# EAGLE design Maduino Zero Lorawan Node v1.0 (EAGLE 6.1)
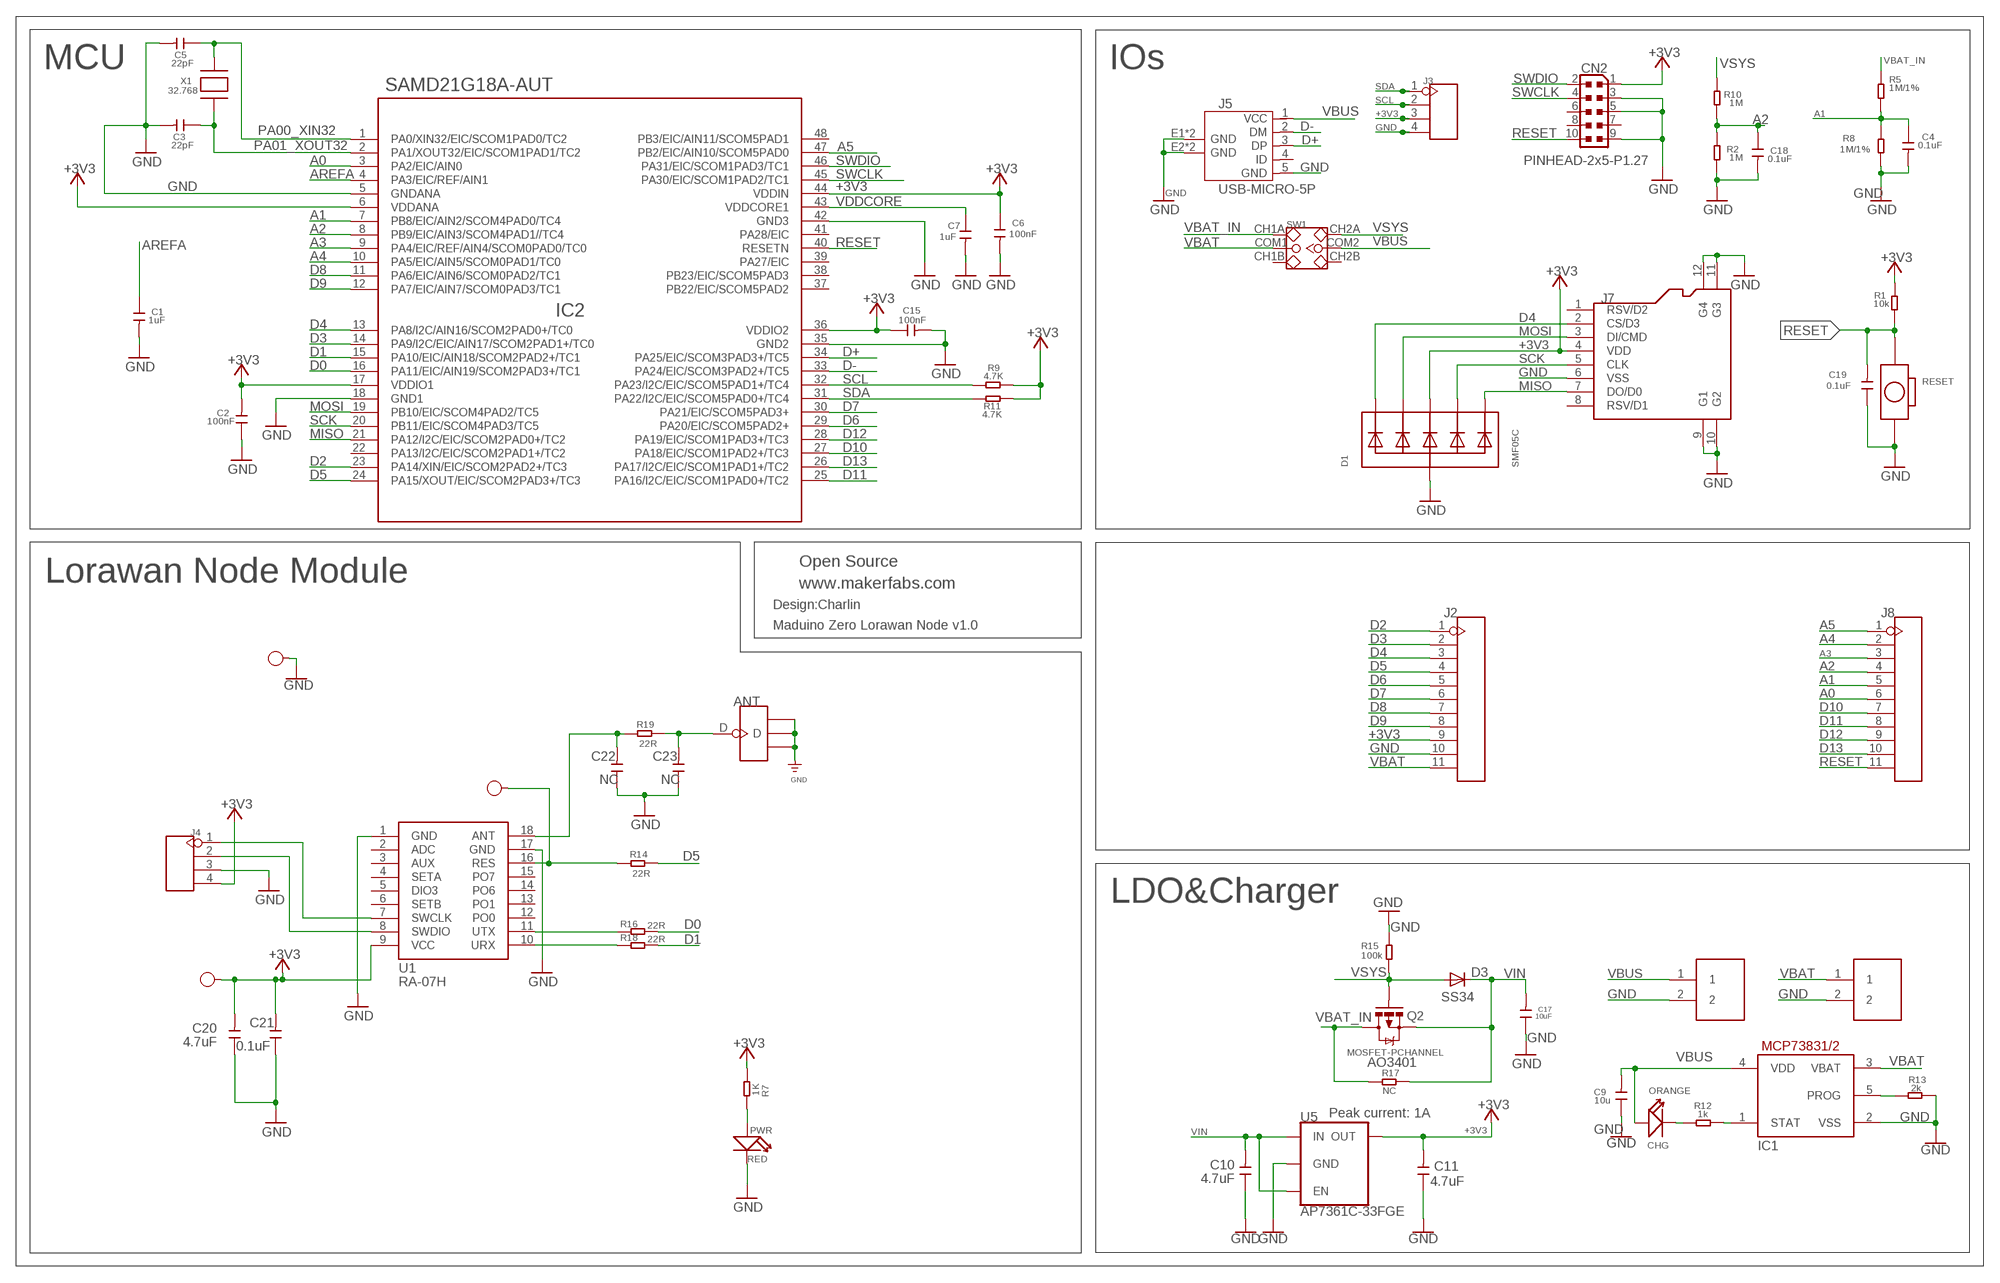
[diagram p0: schematic, sheet 1]

## Parts
3V3  TEST-POINT'4545'  [TP-D45MIL]
ANT  ANTENNA-U-FL  [4P-U-FL]
C1  1uF  C-0603  [C0603]
C2  100nF  C-0603  [C0603]
C3  22pF  C-0603  [C0603]
C4  0.1uF  C-0603  [C0603]
C5  22pF  C-0603  [C0603]
C6  100nF  C-0603  [C0603]
C7  1uF  C-0603  [C0603]
C9  10u  C-0603  [C0603]
C10  4.7uF  C-0603  [C0603]
C11  4.7uF  C-0603  [C0603]
C15  100nF  C-0603  [C0603]
C17  10uF  C-0603  [C0603]
C18  0.1uF  C-0603  [C0603]
C19  0.1uF  C-0603  [C0603]
C20  4.7uF  C-0603  [C0603]
C21  0.1uF  C-0603  [C0603]
C22  NC  C-0603  [C0603]
C23  NC  C-0603  [C0603]
CHG  ORANGE  007-LED0603  [D0603]
CN2  PINHEAD-2x5-P1.27  0171_PH127-205DF055G00AROUND-PADS  [PINHEAD_2X05_127]
D1  SMF05C  TVSARRAY_5LANE  [SOT363]
D3  SS34  DIODE-DO-214AC  [DO-214AC]
GND  TEST-POINT'4545'  [TP-D45MIL]
IC1  MCP73831/OT  [SOT23-5L]
IC2  SAMD21G18A-AUT  ATSAMD21G18A-AUT  [TQFP48-7X7]
J1  PH2.0-2P-90-DIP  [PH2.0-2P-90-DIP]
J2  HEADER-11P-2.54  [11P-2.54]
J3  HEADER-4P-60/35MILROUND  [4P-65/35ROUND]
J4  HEADER-4P-60/35MILROUND  [4P-65/35ROUND]
J5  USB-MICRO-5P  [MICRO-USB-5P]
J6  PH2.0-2P-90-DIP  [PH2.0-2P-90-DIP]
J7  HOLDER-MICROSD-8P  [8P-SMD]
J8  HEADER-11P-2.54  [11P-2.54]
PWR  RED  LED'0603'  [LED-0603]
Q2  MOSFET-PCHANNEL  [SOT23-3]
R1  10k  R-0603  [R0603]
R2  1M  R-0603  [R0603]
R5  1M/1%  R-0603  [R0603]
R7  1K  R-0603  [R0603]
R8  1M/1%  R-0603  [R0603]
R9  4.7K  R-0603  [R0603]
R10  1M  R-0603  [R0603]
R11  4.7K  R-0603  [R0603]
R12  1k  R-0603  [R0603]
R13  2k  R-0603  [R0603]
R14  22R  R-0603  [R0603]
R15  100k  R-0603  [R0603]
R16  22R  R-0603  [R0603]
R17  NC  R-0603  [R0603]
R18  22R  R-0603  [R0603]
R19  22R  R-0603  [R0603]
RES  TEST-POINT'4545'  [TP-D45MIL]
RESET  BOTTON-2P-90D  [2P-7.62X3.56-90D]
SW1  SWITCH-2CH-6P  [6P-2CH-2.54-7.6X3.0]
U1  RA-07H  [SMD18-127P-1600L1600W]
U5  AP7361C-33FGE  [8-UDFN]
X1  32.768  XTAL-3.2X1.5  [XTAL3215]

## Nets
+3V3: 3V3.T C2.2 C6.1 C11.2 C15.1 C20.2 C21.2 CN2.1 D1.4(C3) IC2.6(VDDANA) IC2.17(VDDIO1) IC2.36(VDDIO2) IC2.44(VDDIN) J2.9 J3.3 J4.4 J7.4(VDD) R1.2 R7.1 R9.2 R11.2 U1.9(VCC) U5.1(OUT)
A0: IC2.3(PA2/EIC/AIN0) J8.6
A1: C4.1 IC2.7(PB8/EIC/AIN2/SCOM4PAD0/TC4) J8.5 R5.1 R8.2
A2: C18.1 IC2.8(PB9/EIC/AIN3/SCOM4PAD1//TC4) J8.4 R2.2 R10.1
A3: IC2.9(PA4/EIC/REF/AIN4/SCOM0PAD0/TC0) J8.3
A4: IC2.10(PA5/EIC/AIN5/SCOM0PAD1/TC0) J8.2
A5: IC2.47(PB2/EIC/AIN10/SCOM5PAD0) J8.1
AREFA: C1.1 IC2.4(PA3/EIC/REF/AIN1)
D0: IC2.16(PA11/EIC/AIN19/SCOM2PAD3+/TC1) R16.2
D1: IC2.15(PA10/EIC/AIN18/SCOM2PAD2+/TC1) R18.2
D2: IC2.23(PA14/XIN/EIC/SCOM2PAD2+/TC3) J2.1
D3: IC2.14(PA9/I2C/EIC/AIN17/SCOM2PAD1+/TC0) J2.2
D4: D1.1(C1) IC2.13(PA8/I2C/AIN16/SCOM2PAD0+/TC0) J2.3 J7.2(CS/D3)
D5: IC2.24(PA15/XOUT/EIC/SCOM2PAD3+/TC3) J2.4 R14.2
D6: IC2.29(PA20/EIC/SCOM5PAD2+) J2.5
D7: IC2.30(PA21/EIC/SCOM5PAD3+) J2.6
D8: IC2.11(PA6/EIC/AIN6/SCOM0PAD2/TC1) J2.7
D9: IC2.12(PA7/EIC/AIN7/SCOM0PAD3/TC1) J2.8
D10: IC2.27(PA18/EIC/SCOM1PAD2+/TC3) J8.7
D11: IC2.25(PA16/I2C/EIC/SCOM1PAD0+/TC2) J8.8
D12: IC2.28(PA19/EIC/SCOM1PAD3+/TC3) J8.9
D13: IC2.26(PA17/I2C/EIC/SCOM1PAD1+/TC2) J8.10
D+: IC2.34(PA25/EIC/SCOM3PAD3+/TC5) J5.3(DP)
D-: IC2.33(PA24/EIC/SCOM3PAD2+/TC5) J5.2(DM)
GND: ANT.GND1 ANT.GND2 ANT.GND3 C1.2 C2.1 C3.2 C4.2 C5.2 C6.2 C7.2 C9.1 C10.1 C11.1 C15.2 C17.1 C18.2 C19.1 C20.1 C21.1 C22.1 C23.1 CN2.3 CN2.5 CN2.9 D1.2(A) GND.T IC1.2(VSS) IC2.5(GNDANA) IC2.18(GND1) IC2.35(GND2) IC2.42(GND3) J1.2 J2.10 J3.4 J4.3 J5.5(GND) J5.E1(GND) J5.E2(GND) J5.P1(GND) J5.P2(GND) J6.2 J7.6(VSS) J7.9(G1) J7.10(G2) J7.11(G3) J7.12(G4) PWR.- R2.1 R8.1 R13.2 R15.2 RESET.P$2 U1.1(GND) U1.17(GND) U5.4(GND) U5.EP(GND)
MISO: D1.6(C5) IC2.21(PA12/I2C/EIC/SCOM2PAD0+/TC2) J7.7(DO/D0)
MOSI: D1.3(C2) IC2.19(PB10/EIC/SCOM4PAD2/TC5) J7.3(DI/CMD)
N$3: PWR.+ R7.2
N$4: R16.1 U1.11(UTX)
N$5: R18.1 U1.10(URX)
N$6: R14.1 RES.T U1.16(RES)
N$8: J4.1 U1.7(SWCLK)
N$9: J4.2 U1.8(SWDIO)
N$12: C22.2 R19.1 U1.18(ANT)
N$13: ANT.D C23.2 R19.2
N$25: CHG.- R12.1
N$26: IC1.1(STAT) R12.2
N$31: IC1.5(PROG) R13.1
PA00_XIN32: C5.1 IC2.1(PA0/XIN32/EIC/SCOM1PAD0/TC2) X1.P$2
PA01_XOUT32: C3.1 IC2.2(PA1/XOUT32/EIC/SCOM1PAD1/TC2) X1.P$1
RESET: C19.2 CN2.10 IC2.40(RESETN) J8.11 R1.1 RESET.P$1
SCK: D1.5(C4) IC2.20(PB11/EIC/SCOM4PAD3/TC5) J7.5(CLK)
SCL: IC2.32(PA23/I2C/EIC/SCOM5PAD1+/TC4) J3.2 R9.1
SDA: IC2.31(PA22/I2C/EIC/SCOM5PAD0+/TC4) J3.1 R11.1
SWCLK: CN2.4 IC2.45(PA30/EIC/SCOM1PAD2/TC1)
SWDIO: CN2.2 IC2.46(PA31/EIC/SCOM1PAD3/TC1)
VBAT: IC1.3(VBAT) J2.11 J6.1 SW1.COM1
VBAT_IN: Q2.3(D) R5.2 R17.1 SW1.CH1A
VBUS: C9.2 CHG.+ IC1.4(VDD) J1.1 J5.1(VCC) SW1.COM2
VDDCORE: C7.1 IC2.43(VDDCORE1)
VIN: C10.2 C17.2 D3.C Q2.2(S) R17.2 U5.5(EN) U5.8(IN)
VSYS: D3.A Q2.1(G) R10.2 R15.1 SW1.CH2A
Unconnected: CN2.6 CN2.7 CN2.8 IC2.22(PA13/I2C/EIC/SCOM2PAD1+/TC2) IC2.37(PB22/EIC/SCOM5PAD2) IC2.38(PB23/EIC/SCOM5PAD3) IC2.39(PA27/EIC) IC2.41(PA28/EIC) IC2.48(PB3/EIC/AIN11/SCOM5PAD1) J5.4(ID) J7.1(RSV/D2) J7.8(RSV/D1) SW1.CH1B SW1.CH2B U1.2(ADC) U1.3(AUX) U1.4(SETA) U1.5(DIO3) U1.6(SETB) U1.12(PO0) U1.13(PO1) U1.14(PO6) U1.15(PO7)

## Notes on the sheet
- MCU | IOs
- Open Source
- Lorawan Node Module
- www.makerfabs.com
- Design:Charlin
- Maduino Zero Lorawan Node v1.0
- LDO&Charger
- AO3401
- Peak current: 1A

## Library data of the parts
3V3 GND RES = Discrete-new:TEST-POINT; PARTNO: DNP
ANT = Connector:ANTENNA-U-FL
C1-C7 C9-C11 C15 C17-C23 = Discrete:C*: Ceramic Capacitors
CHG = Discrete:007-LED*
CN2 = Connettori:0171_PH127-205DF055G00A: 2x5 PASSO 1,27
D1 = microbuilder:TVSARRAY_5LANE: Voltage Transient Suppressor Array SOT363 SMF05C - 100W 5V: Digikey - SMF05CT1GOSCT-ND
D3 = diode:DIODE-: DIODE
IC1 = adafruit:MCP73831: MCP73831/2 Miniature Single-Cell, Fully Integrated Li-Ion, Li-Polymer Charge Management Controllers. Nice and small simple lipoly charge controller, with adjustable current and status output (LED) http://www.ladyada.net/library/pcb/eaglelibrary.html
IC2 = IC:ATSAMD21G18A-AUT: Atmel D21 32bit ARM Cortex-M0 microcontroller - 48 PIN TQFP 256KB flash memory + 32KB SRAM
J1 J6 = Connector:PH2.0-2P-90-DIP
J2 J8 = Connector:HEADER-11P
J3 J4 = Connector:HEADER-4P
J5 = Connector:USB-MICRO-5P
J7 = Connector:HOLDER-MICROSD-8P
PWR = Discrete:LED*
Q2 = User-Submitted:MOSFET-PCHANNEL: Generic PMOSFET IRLML2244 - TRANS-11153 (SOT-23 -20V -4.3A) (1.Gate 2.Source 3.Drain) FQP27P06 - COM-10349 <http://www.sparkfun.com/products/10349> (TO-220 -60V -27A) (1.Gate 2.Source 3.Drain); PROD_ID: TRANS-08285
R1 R2 R5 R7-R19 = Discrete:R*
RESET = Discrete:BOTTON-2P
SW1 = Discrete:SWITCH-2CH-6P
U1 = self:RA-07H
U5 = ublox:AP7361C-33FGE: AP7361C 3.3V LDO Regulator; PROD_ID: VREG-14094
X1 = adafruit2:XTAL: Low cost SMT crystals, no capacitors included http://www.ladyada.net/library/eagle

## Net classes
0 default: width 0.203 mm, drill 0.305 mm, clearance 0.152 mm
2 gnd: width 0.305 mm, drill 0.559 mm, clearance 0.254 mm
3 usbvcc: width 0.508 mm, drill 0.61 mm, clearance 0.254 mm
4 USBpair: width 0.254 mm, drill 0.406 mm, clearance 0.406 mm

## Board
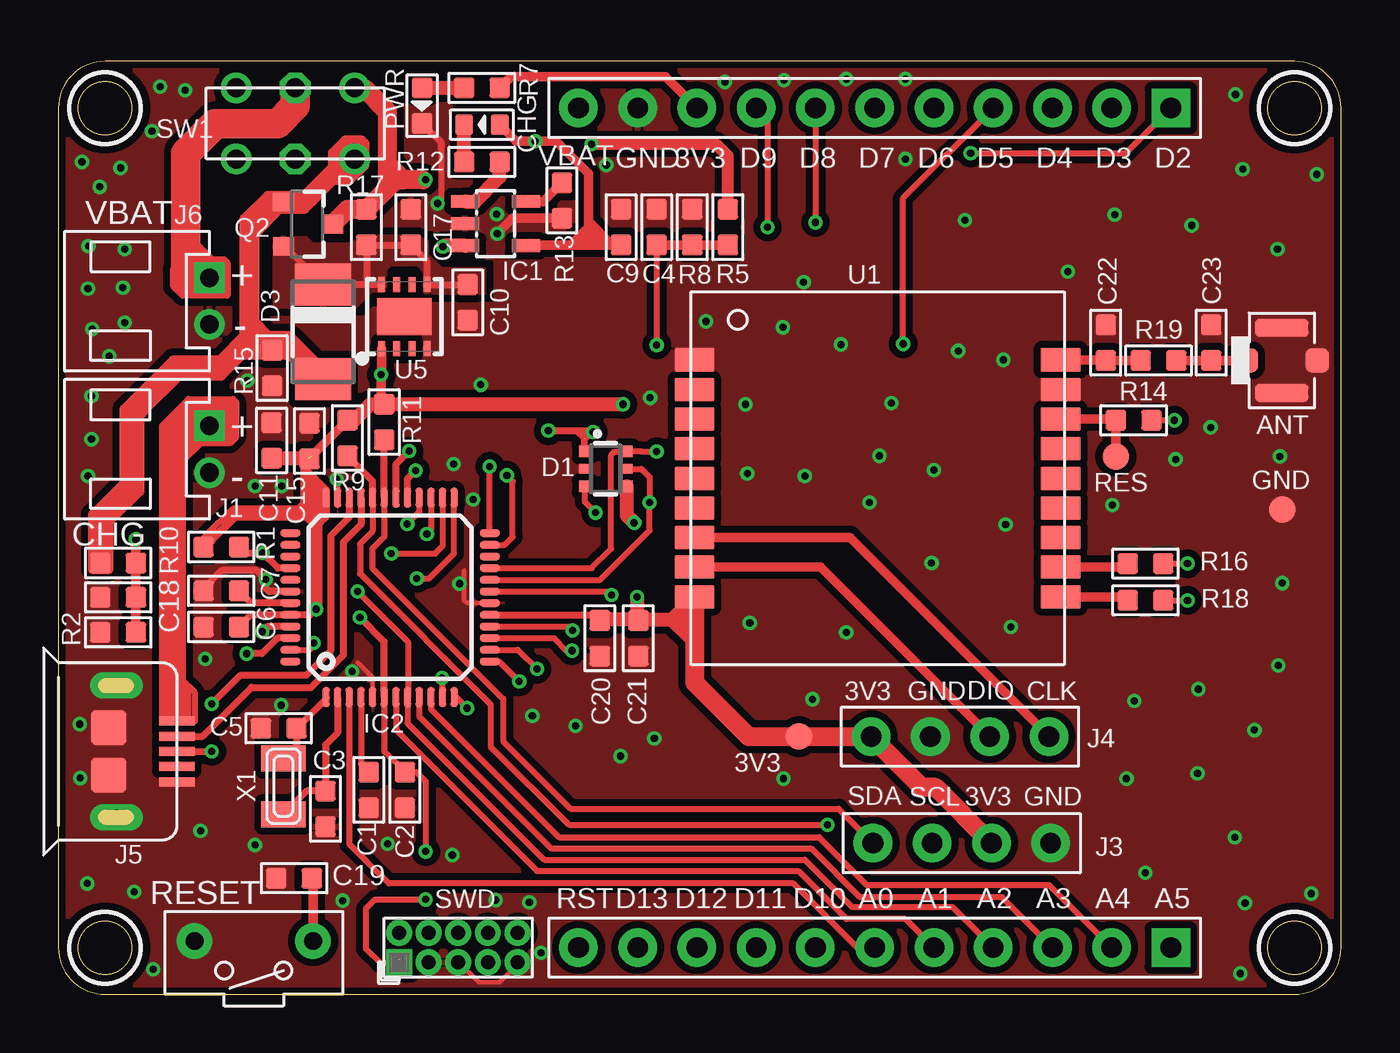
[diagram p1: board, top side]
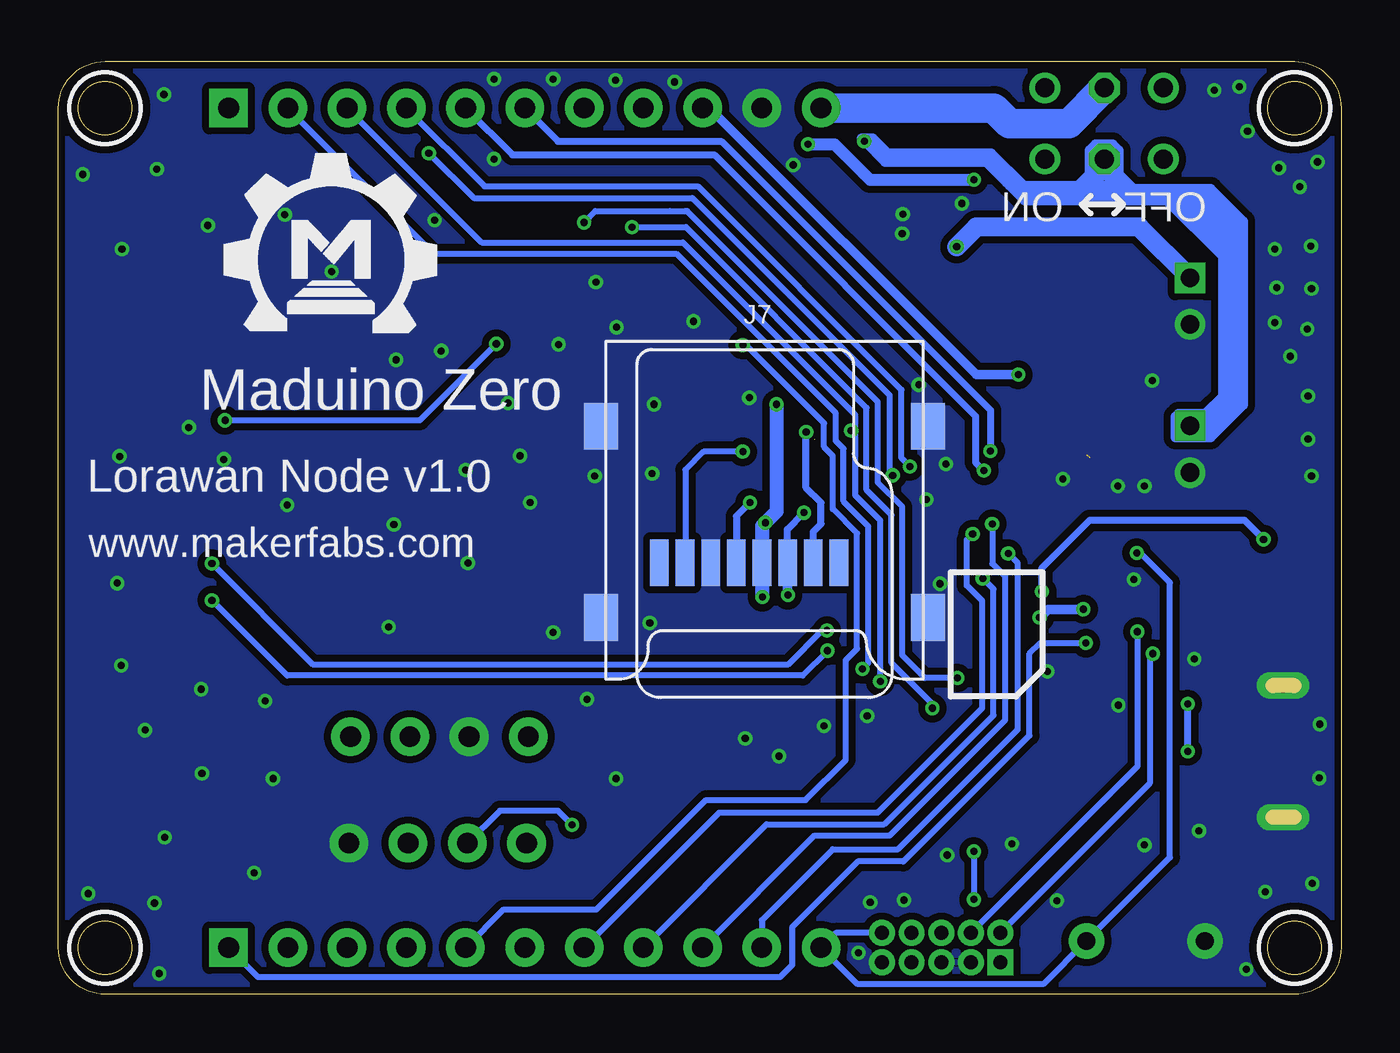
[diagram p2: board, bottom side, seen from below]

Size 55 x 40 mm. Coordinates in mm from the lower left corner, seen from the top.
Outline: 0,38 0,2 arc90 2,0 53,0 arc90 55,2 55,38 arc90 53,40 2,40 arc90 0,38
Outline: circle at 53,2 radius 1.14
Outline: circle at 53,38 radius 1.14
Outline: circle at 2,2 radius 1.14
Outline: circle at 2,38 radius 1.14
Copper layers (1*16): Top 0.035mm / dielectric 1.5mm / Bottom 0.035mm
Design rules: minimum track width 6mil, minimum drill 10mil, track to track 6mil, track to pad 6mil, pad to pad 6mil, via to via 6mil, smd to smd 0mil, copper to edge 10mil, drill to drill 10mil, minimum pad ring 10mil, minimum via ring 6mil, stop-mask expansion 2mil, vias tented up to drill 30mil, thermal gap 0mil
tRestrict: area 51.5,0.5 to 54.5,3.5; area 51.5,36.5 to 54.5,39.5; area 0.5,0.5 to 3.5,3.5; area 0.5,36.5 to 3.5,39.5
bRestrict: area 51.5,0.5 to 54.5,3.5; area 51.5,36.5 to 54.5,39.5; area 0.5,0.5 to 3.5,3.5; area 0.5,36.5 to 3.5,39.5

### Footprints (pad centres in the part's own frame; a part is rotated, then mirrored left to right if it is on the bottom)
TP-D45MIL = smd 1.143 x 1.143: T 0,0
4P-U-FL = smd 1.016 x 1.016: D -1.524,0; GND3 1.524,0 | smd 2.286 x 0.762: GND1 0,1.397; GND2 0,-1.397
C0603 = smd 0.889 x 0.889: 1 -0.762,0; 2 0.762,0
D0603 = smd 0.762 x 0.889: + -0.762,0; - 0.762,0
PINHEAD_2X05_127 = drill 0.6 pad 1.016 square: 1 -0.635,2.54 | drill 0.6 pad 1.016: 2 0.635,2.54; 3 -0.635,1.27; 4 0.635,1.27; 5 -0.635,0; 6 0.635,0; 7 -0.635,-1.27; 8 0.635,-1.27; 9 -0.635,-2.54; 10 0.635,-2.54
SOT363 = smd 0.5 x 0.5: 1 -0.75,-0.9; 3 0.75,-0.9; 4 0.75,0.9; 6 -0.75,0.9 | smd 0.4 x 0.5: 2 0,-0.9; 5 0,0.9
DO-214AC = smd 1.8 x 2.4: A 2.025,0; C -2.025,0
SOT23-5L = smd 0.55 x 1.2: 1 -0.95,-1.3; 2 0,-1.3; 3 0.95,-1.3; 4 0.95,1.3; 5 -0.95,1.3
TQFP48-7X7 = smd 0.85 x 0.32: 1 -4.275,2.75; 2 -4.275,2.25; 3 -4.275,1.75; 4 -4.275,1.25; 5 -4.275,0.75; 6 -4.275,0.25; 7 -4.275,-0.25; 8 -4.275,-0.75; 9 -4.275,-1.25; 10 -4.275,-1.75; 11 -4.275,-2.25; 12 -4.275,-2.75; 25 4.275,-2.75; 26 4.275,-2.25; 27 4.275,-1.75; 28 4.275,-1.25; 29 4.275,-0.75; 30 4.275,-0.25; 31 4.275,0.25; 32 4.275,0.75; 33 4.275,1.25; 34 4.275,1.75; 35 4.275,2.25; 36 4.275,2.75 | smd 0.32 x 0.85: 13 -2.75,-4.275; 14 -2.25,-4.275; 15 -1.75,-4.275; 16 -1.25,-4.275; 17 -0.75,-4.275; 18 -0.25,-4.275; 19 0.25,-4.275; 20 0.75,-4.275; 21 1.25,-4.275; 22 1.75,-4.275; 23 2.25,-4.275; 24 2.75,-4.275; 37 2.75,4.275; 38 2.25,4.275; 39 1.75,4.275; 40 1.25,4.275; 41 0.75,4.275; 42 0.25,4.275; 43 -0.25,4.275; 44 -0.75,4.275; 45 -1.25,4.275; 46 -1.75,4.275; 47 -2.25,4.275; 48 -2.75,4.275
PH2.0-2P-90-DIP = drill 0.8 square: 1 0,1 | drill 0.8: 2 0,-1
11P-2.54 = drill 0.889 pad 1.651 square: 1 0,12.7 | drill 0.889 pad 1.651: 2 0,10.16; 3 0,7.62; 4 0,5.08; 5 0,2.54; 6 0,0; 7 0,-2.54; 8 0,-5.08; 9 0,-7.62; 10 0,-10.16; 11 0,-12.7
4P-65/35ROUND = drill 0.889 pad 1.651: 1 0,3.81; 2 0,1.27; 3 0,-1.27; 4 0,-3.81
MICRO-USB-5P = smd 0.38 x 1.52: 1 -1.3,0; 2 -0.65,0; 3 0,0; 4 0.65,0; 5 1.3,0 | smd 1.524 x 1.524: E1 -1.016,-2.921; E2 1.016,-2.921 | drill 0.635 pad 1.143 long: P1 -2.819,-2.591; P2 2.819,-2.591
8P-SMD = smd 0.8 x 2.008: 1 -3.198,0.254; 2 -2.098,0.254; 3 -0.998,0.254; 4 0.102,0.254; 5 1.202,0.254; 6 2.302,0.254; 7 3.402,0.254; 8 4.502,0.254 | smd 1.45 x 2: 9 -7.002,2.6; 10 7.002,2.6; 11 -7.002,-5.598; 12 7.002,-5.598
LED-0603 = smd 0.889 x 0.889: + -0.762,0; - 0.762,0
SOT23-3 = smd 0.8 x 0.9: 1 -0.95,-1; 2 0.95,-1; 3 0,1.1
R0603 = smd 0.889 x 0.889: 1 -0.762,0; 2 0.762,0
2P-7.62X3.56-90D = drill 0.762 pad 1.524: P$1 0,2.54; P$2 0,-2.54
6P-2CH-2.54-7.6X3.0 = drill 0.813 pad 1.27: CH1A -1.524,2.54; CH1B -1.524,-2.54; CH2A 1.524,2.54; CH2B 1.524,-2.54 | drill 0.813 pad 1.27 octagon: COM1 -1.524,0; COM2 1.524,0
SMD18-127P-1600L1600W = smd 1.7 x 1: 1 -7.85,5.08; 2 -7.85,3.81; 3 -7.85,2.54; 4 -7.85,1.27; 5 -7.85,0; 6 -7.85,-1.27; 7 -7.85,-2.54; 8 -7.85,-3.81; 9 -7.85,-5.08; 10 7.85,-5.08; 11 7.85,-3.81; 12 7.85,-2.54; 13 7.85,-1.27; 14 7.85,0; 15 7.85,1.27; 16 7.85,2.54; 17 7.85,3.81; 18 7.85,5.08
8-UDFN = smd 0.3 x 0.65: 1 -0.975,-1.375; 2 -0.325,-1.375; 3 0.325,-1.375; 4 0.975,-1.375; 5 0.975,1.375; 6 0.325,1.375; 7 -0.325,1.375; 8 -0.975,1.375 | smd 2.35 x 1.6: EP 0,0
XTAL3215 = smd 1.1 x 1.9: P$1 1.2,0; P$2 -1.2,0

### Placement (x,y rotation side)
3V3  31.75,11.05 0 top
ANT  52.45,27.18 0 top
C1  13.31,8.76 270 top
C2  14.86,8.76 90 top
C3  11.46,7.95 270 top
C4  25.65,32.89 90 top
C5  9.45,11.4 180 top
C6  6.99,15.75 180 top
C7  6.99,17.3 180 top
C9  24.13,32.89 270 top
C10  17.55,29.67 90 top
C11  9.14,23.75 270 top
C15  10.77,23.72 90 top
C17  15.11,32.89 270 top
C18  2.57,17.02 180 top
C19  10.11,4.98 0 top
C20  23.22,15.27 90 top
C21  24.87,15.27 90 top
C22  44.91,27.94 270 top
C23  49.43,27.94 270 top
CHG  18.16,37.29 180 top
CN2  17.14,2 90 top
D1  23.47,22.53 270 top
D3  11.35,28.4 270 top
GND  52.48,20.78 0 top
IC1  18.75,33.05 270 top
IC2  14.22,17.02 90 top
J1  6.48,23.37 0 top
J2  35,38 270 top
J3  38.73,6.48 90 top
J4  38.66,11.05 270 top
J5  5.08,10.41 270 top
J6  6.48,29.72 0 top
J7  24.73,18.76 180 bottom
J8  35,2 270 top
PWR  15.6,38.1 270 top
Q2  10.67,33.02 270 top
R1  6.99,19.18 180 top
R2  2.57,15.52 0 top
R5  28.7,32.89 90 top
R7  18.16,38.86 180 top
R8  27.18,32.89 270 top
R9  12.4,23.85 90 top
R10  2.57,18.49 180 top
R11  13.97,24.54 90 top
R12  18.16,35.69 0 top
R13  21.59,34.04 270 top
R14  46.1,24.61 0 top
R15  9.17,26.85 270 top
R16  46.61,18.47 0 top
R17  13.21,32.89 270 top
R18  46.61,16.89 0 top
R19  47.17,27.18 0 top
RES  45.34,23.06 0 top
RESET  8.38,2.29 270 top
SW1  10.16,37.34 270 top
U1  35.13,22.12 0 top
U5  14.83,29.06 0 top
U$1  [MAKERFABS_0.3]  47.43,28.42 0 bottom
X1  9.65,8.92 270 top

### Tracks (layer width: path | path; a pad name or v marks a point on that pad's centre or on a via)
+3V3  (via drill 0.3)  (1 unrouted)
  Top 0.254: 11.43,21.72 11.43,21.08 10.92,20.57 11.18,20.57 11.43,20.83 11.43,20.57 | 11.43,21.72 10.67,22.48 10.67,21.21 10.29,20.83 7.49,20.83 6.35,19.68 6.6,19.43 7.62,20.45 10.79,20.45 | 11.43,20.57 11.35,20.5 11.2,20.5 10.72,20.98 10.72,22.05 10.82,22.15 10.82,22.07 11.3,21.59 11.3,21.26 10.97,20.93 10.97,21.72 10.87,21.82 10.9,21.82 11.12,21.59 11.12,21.31 | 11.51,21.31 11.51,20.65 11.43,20.57 | 11.43,21.72 11.51,21.64 11.51,20.68 11.35,20.52 | 6.66,19.89 6.55,19.89 6.12,19.46 6.12,19.28 R1.2 | CN2.1 14.59,1.35 13.79,1.35 13.18,1.96 13.18,3.66 13.59,4.06 v15.75,4.06 | IC2.6 13.97,10.41 C2.2 15.34,9.53 15.75,9.12 v15.75,6.12
  Top 0.305: IC2.6 13.97,15.11 v12.93,16.15 | v11.05,16.51 10.79,16.26 9.91,16.26 | IC2.36 11.47,21.13 11.43,21.08 11.05,20.7 | 11.05,20.7 11.05,20.19 | IC2.44 9.92,16.27 9.91,16.26 | 10.67,20.7 11.05,20.7 | 10.67,20.7 10.54,20.83 10.54,22.73 C15.1 | R1.2 7.75,20.7 10.67,20.7 | 9.91,16.26 8.26,16.26 C6.1 | IC2.17 23.27,16.27 23.22,16.22 C20.2 | C21.2 24.87,16.19 24.94,16.27
  Top 0.406: 10.54,23.11 10.9,23.11 R9.2 | U5.1 13.86,26.58 v13.84,26.57 13.84,25.43 | R7.1 19.41,39.34 26.04,39.34 J2.9 | J2.9
  Top 0.508: 11.05,20.19 v11.05,16.51 | 10.79,20.45 11.05,20.19 | 11.05,20.19 11.35,20.5
  Top 0.61: C11.2 10.74,22.99 C15.1 | R9.2 12.7,24.61 13.39,25.3 R11.2 | D1.4 24.37,20.54 v24.69,20.22 | v24.82,17.03 24.82,16.08 | 24.82,16.08 C21.2 | 24.82,16.08 26.29,16.08 | 26.29,16.08 26.31,16.08 | 26.31,16.08 27.25,16.08 27.28,16.05 | 24.82,16.08 23.27,16.08 C20.2 | 26.31,16.08 27.2,16.97 27.2,15.16 | 27.2,15.14 27.2,15.16 | 27.2,15.16 26.29,16.08 | R11.2 v24.21,25.3 | R11.2 13.84,25.43
  Top 0.813: U1.9 27.28,16.05 27.28,13.36 29.59,11.05 3V3.T J4.4 37.03,8.87 37.62,8.87 J3.3
  Bottom 0.254: 24.82,18.52 J7.4 | v15.75,6.12 v15.75,4.06
  Bottom 0.305: v11.05,16.5 v11.05,16.51
  Bottom 0.406: J2.9 27.08,38 15.65,26.57 v13.84,26.57 | v11.05,16.5 12.58,16.5 v12.93,16.15
  Bottom 0.61: 24.82,18.52 24.82,20.09 v24.69,20.22 24.21,20.7 v24.21,25.3 | J7.4 24.83,17.04 v24.82,17.03
A0
  Top 0.254: IC2.3 12.47,6.45 13.07,5.86 13.26,5.66 14.17,4.75 31.52,4.75 34.27,2 J8.6
A1  (via drill 0.3)
  Top 0.254: IC2.7 14.47,11.33 20.52,5.28 31.73,5.28 33.78,3.23 36.31,3.23 J8.5 | C4.1 v25.65,27.84
  Top 0.406: C4.1 R8.2 R5.1
  Bottom 0.254: J8.5 35.91,3.63 31.93,3.63 27.23,8.33 22.96,8.33 21.23,10.06 21.23,14.33 20.75,14.81 20.75,19.76 21.79,20.8 21.79,23.09 22.17,23.47 22.17,24.49 25.53,27.84 v25.65,27.84
A2  (via drill 0.3)
  Top 0.254: 14.99,12.76 14.99,15.11 v12.83,17.27 | IC2.8 14.97,11.62 20.83,5.77 32,5.77 34.04,3.73 38.35,3.73 J8.4
  Top 0.305: 14.99,12.76 IC2.8
  Top 0.406: R2.2 C18.1 R10.1 v3.33,19.51
  Bottom 0.305: v12.83,17.27 12.83,18.29 10.79,20.32 4.14,20.32 v3.33,19.51
A3
  Top 0.254: IC2.9 15.47,11.91 21.13,6.25 32.28,6.25 34.37,4.17 40.45,4.17 J8.3
A4
  Top 0.254: IC2.10 15.97,12.22 21.46,6.73 32.61,6.73 34.67,4.67 42.49,4.67 J8.2
A5  (via drill 0.3)
  Top 0.254: IC2.47 10.78,14.77 10.95,14.94 v10.95,15.06
  Bottom 0.254: J8.1 46.44,0.74 24.05,0.74 23.55,1.25 23.55,2.87 20.73,5.69 18.77,5.69 13.36,11.1 13.36,14.61 12.9,15.06 v10.95,15.06
AREFA
  Top 0.254: IC2.4 12.97,9.86 C1.1
D0  (via drill 0.3)
  Top 0.254: IC2.16 21.88,15.77 v22.05,15.6 | R16.2 v48.41,18.47
  Bottom 0.254: v48.41,18.47 44.09,14.15 23.7,14.15 22.25,15.6 v22.05,15.6
D1  (via drill 0.3)
  Top 0.254: IC2.15 21.26,15.27 21.79,14.73 v22.02,14.73 | R18.2 v48.41,16.89
  Bottom 0.254: v22.02,14.73 23.09,13.66 45.19,13.66 v48.41,16.89
D2  (via drill 0.3)
  Top 0.254: IC2.23 19.14,19.27 19.48,19.61 19.48,22 v19.23,22.25 | v39.12,36.07 45.77,36.07 J2.1
  Bottom 0.254: v39.12,36.07 37.19,34.14 27.81,34.14 19.36,25.68 19.36,22.38 v19.23,22.25
D3  (via drill 0.3)
  Top 0.254: IC2.14 19.7,14.77 v20.52,13.95
  Bottom 0.254: J2.2 38.91,31.75 28.5,31.75 21.67,24.92 21.67,23.72 21.34,23.39 21.34,21.13 20.27,20.07 20.27,14.2 v20.52,13.95
D4  (via drill 0.3)  (1 unrouted)
  Top 0.254: IC2.13 18.9,14.27 v19.76,13.41 | 22.58,23.8 22.91,24.13 | 22.55,23.8 22.55,23.82 22.23,24.16
  Top 0.305: D1.1 22.57,24.03 22.43,24.17 | v21.01,24.17 22.43,24.17 | 22.43,24.17 22.87,24.17 22.91,24.13 v22.94,24.11
  Bottom 0.254: J2.3 36.85,32.23 28.22,32.23 20.83,24.84 20.83,24.21 | v19.76,13.41 19.76,20.32 20.83,21.39 20.83,24.21 | v21.01,24.17 20.87,24.17 20.83,24.21
  Bottom 0.305: J7.2 22.63,19.84 22.3,20.17 22.3,21.08 22.94,21.72 v22.94,24.11
D5  (via drill 0.3)
  Top 0.254: R14.2 v47.85,24.61 | v36.22,27.89 36.22,34.14 J2.4 | IC2.24 v18.5,22.62 v18.49,22.63
  Bottom 0.254: v47.85,24.61 39.5,24.61 v36.22,27.89 | J2.4 36.73,34.65 27.58,34.65 18.85,25.91 18.85,22.99 v18.49,22.63
D6  (via drill 0.3)
  Top 0.305: IC2.29 14.97,22.11 v15.32,22.45
  Bottom 0.305: J2.5 35.53,35.99 26.87,35.99 15.67,24.79 15.67,22.81 v15.32,22.45
D7  (via drill 0.3)
  Top 0.305: IC2.30 14.47,22.73 v15.04,23.29
  Bottom 0.305: J2.6 33.58,36.58 26.57,36.58 15.04,25.04 v15.04,23.29
D8  (via drill 0.3)
  Top 0.254: IC2.11 16.47,13.55 v16.46,13.56 | J2.7 v32.46,33.1
  Bottom 0.254: v32.46,33.1 31.98,33.58 28.78,33.58 28.12,33.58 28.04,33.58 19.86,25.4 19.86,21.95 18.82,20.9 18.82,14.53 17.86,13.56 v16.46,13.56
D9  (via drill 0.3)
  Top 0.254: J2.8 30.4,37.52 v30.4,32.89 | IC2.12 17.05,12.74 v17.53,12.27
  Bottom 0.254: v30.4,32.89 28.09,32.89 20.34,25.15 20.34,21.61 19.28,20.55 19.28,14.2 17.53,12.45 v17.53,12.27
D10  (via drill 0.3)
  Top 0.254: IC2.27 15.97,19.91 v15.8,19.74
  Bottom 0.254: J8.7 26.66,7.8 19.86,7.8 15.39,12.27 15.39,16.87 16.05,17.53 16.05,19.48 v15.8,19.74
D11  (via drill 0.3)
  Top 0.254: IC2.25 16.97,18.9 15.9,17.83 v15.37,17.83
  Bottom 0.254: v15.37,17.83 14.91,17.37 14.91,11.96 19.58,7.29 24.63,7.29 J8.8
D12  (via drill 0.3)
  Top 0.254: IC2.28 15.47,20.68 v14.96,20.17
  Bottom 0.254: v14.96,20.17 14.96,18.47 14.4,17.91 14.4,11.76 19.36,6.81 22.57,6.81 J8.9
D13  (via drill 0.3)
  Top 0.254: IC2.26 16.47,19.22 16.15,18.9 v14.28,18.9
  Bottom 0.254: v14.28,18.9 13.87,18.49 13.87,11.35 19,6.22 21.79,6.22 24.84,3.17 J8.10
D+  (via drill 0.3)
  Top 0.305: IC2.34 12.47,20.45 11.68,19.66 11.68,14.73 10.64,13.69 7.82,13.69 v6.58,12.45 | J5.3 v6.58,10.41
  Bottom 0.305: v6.58,10.41 v6.58,12.45
D-
  Top 0.305: IC2.33 12.97,20.14 12.22,19.38 12.22,14.53 10.85,13.16 8.28,13.16 6.19,11.06 J5.2
GND  (via drill 0.3)
  Top 0.203: IC2.5 13.47,13.58 12.83,14.22 | IC2.18 17.52,16.77 17.4,16.89 17.4,18.16 | 19.75,1.33 19.81,1.4 | CN2.9 19.72,1.36 19.75,1.33 | 19.75,1.33 18.92,0.51 18.03,0.51 17.14,1.4
  Top 0.254: IC2.35 11.97,22.06 v11.94,22.1 | 16.41,36.3 16.41,34.06 v16.26,33.91
  Top 0.305: IC2.42 9.05,17.27 8.89,17.42 v8.89,17.78 8.51,18.16 6.99,18.16 6.22,17.4 C7.2 | PWR.- 16.41,36.52 16.41,36.3
  Top 0.406: R13.2 19.48,33.27 v18.82,32.61
  Bottom 0.203: v8.89,17.78 8.89,17.65 8.76,17.78
  other vias: 23.5,35.56 8.1,26.31 2.18,27.36 0.94,9.27 0.91,11.58 1.45,28.52 50.88,3.91 1.27,30.25 48.84,9.47 2.84,28.8 2.77,30.3 1.27,22.23 1.78,34.62 5.44,38.76 4.37,38.91 1.42,25.65 1.42,23.8 12.6,13.84 40.84,15.75 14.12,6.45 6.3,14.38 20.7,1.78 8.43,6.4 1.24,4.75 3.25,4.39 6.1,7.01 4.06,1.07 16.89,5.97 45.19,20.98 17.2,17.6 50.44,6.73 25.55,10.97 31.09,9.25 45.8,9.25 53.72,4.32 20.19,3.94 18.75,4.04 46.61,5.21 9.58,21.79 8.43,21.79 28.57,39.12 36.32,35.81 33.78,39.24 36.32,39.24 34.77,21.08 46.13,12.57 17.78,21.21 12.19,4.01 43.28,30.99 40.51,27.2 29.54,22.33 48.87,13.08 32.33,12.65 25.37,25.58 22.17,11.51 38.86,33.2 37.44,18.49 24.1,10.21 20.32,11.94 35.2,23.09 37.54,22.48 35.71,25.35 27.76,28.85 29.64,15.93 52.48,17.63 47.9,22.94 52.27,31.95 50.77,35.38 50.47,38.58 53.95,35.15 50.67,0.89 2.84,31.95 29.46,25.3 18.8,33.45 4.01,37.01 16.94,22.73 1.02,35.69 2.67,35.43 1.3,32.08 31.11,39.19 38.58,27.58 52.3,14.1 40.61,20.14 32,22.23 51.28,11.33 52.37,23.06 45.29,33.43 49.4,24.31 31.95,30.53 31.06,28.6 33.55,27.86 33.78,15.52 48.59,32.97 18.11,26.14 9.55,12.4
  pour Bottom (isolate 0.305, rank 6): -1.27,-1.27 60,-1.27 60,45 -1.27,45
  pour Top (isolate 0.305, rank 6): -1.27,-1.27 60,-1.27 60,45 -1.27,45
MISO  (via drill 0.3)
  Top 0.254: IC2.21 22.86,18.27 23.7,19.1 23.7,23.11 23.85,23.27 24.36,23.27 D1.6 24.38,23.27 25.02,23.27 v25.65,23.27
  Bottom 0.254: J7.7 28.12,18.52 28.12,22.48 27.33,23.27 v25.65,23.27
MOSI  (via drill 0.3)
  Top 0.254: D1.3 22.57,21.12 v23.04,20.65 | IC2.19 23.57,17.27 v23.72,17.12
  Bottom 0.203: 23.75,18.54 23.75,18.52 J7.3
  Bottom 0.254: J7.3
  Bottom 0.305: 23.75,18.54 23.75,19.94 v23.04,20.65
  Bottom 0.406: J7.3 v23.73,17.12 v23.72,17.12
N$3
  Top 0.61: PWR.+ R7.2
N$4
  Top 0.406: U1.11 45.7,18.31 R16.1
N$5
  Top 0.406: U1.10 45.7,17.04 R18.1
N$6
  Top 0.406: U1.16 45.29,24.66 R14.1 RES.T
N$8
  Top 0.406: U1.7 33.93,19.58 J4.1
N$9
  Top 0.406: U1.8 32.66,18.31 J4.2
N$12
  Top 0.406: U1.18 44.88,27.2 C22.2 R19.1
N$13
  Top 0.406: R19.2 C23.2 ANT.D
N$25
  Top 0.61: R12.1 CHG.-
N$26
  Top 0.61: IC1.1 17.87,33.99 18.92,35.05 R12.2
N$31
  Top 0.406: IC1.5 20.79,33.99 R13.1
PA00_XIN32
  Top 0.305: IC2.1 11.47,12.67 C5.1 10.21,10.67 X1.P$2
PA01_XOUT32
  Top 0.305: IC2.2 11.97,11.21 11.46,10.69 C3.1 10.65,8.71 X1.P$1
RESET  (via drill 0.3)
  Top 0.305: R1.1 8,18.92 v8.76,18.92 9.42,18.27 IC2.40
  Top 0.406: C19.2 10.92,4.93 RESET.P$1
  Bottom 0.254: CN2.10 21.66,2.63 J8.11 20.73,0.43 12.78,0.43 RESET.P$1 7.34,5.87 7.34,17.65 8.61,18.92 v8.76,18.92
SCK  (via drill 0.3)
  Top 0.254: D1.5 24.99,22.53 25.35,22.17 v25.35,21.08 25.35,19.89 23.23,17.77 IC2.20
  Bottom 0.305: v25.35,21.08 25.93,20.5 J7.5
SCL  (via drill 0.3)
  Top 0.254: IC2.32 13.47,19.85 12.93,19.3 12.93,18.03 18.54,12.42 18.54,10.62 21.89,7.26 v32.97,7.26
  Top 0.305: IC2.32 13.47,22.01 R9.1
  Bottom 0.254: J3.2 36.07,7.87 33.58,7.87 v32.97,7.26
SDA
  Top 0.254: IC2.31 13.97,19.61 13.46,19.1 13.46,18.29 19.07,12.68 19.07,10.85 21.97,7.95 33.45,7.95 J3.1
  Top 0.305: IC2.31 R11.1
SWCLK  (via drill 0.3)
  Top 0.305: IC2.45 8.96,15.77 v8.74,15.54
  Bottom 0.254: v8.74,15.54 8.74,9.77 CN2.4
SWDIO  (via drill 0.3)
  Top 0.305: IC2.46 9.4,15.27 8.74,14.61 v8.08,14.61
  Bottom 0.254: v8.08,14.61 8.2,14.48 8.2,9.04 CN2.2
VBAT  (via drill 0.3)
  Top 0.305: 6.46,30.72 6.48,30.73 | J6.1 6.48,30.73 | 5.84,32.51 5.84,32.26 5.97,32.13 | 5.97,32.13 6.6,31.5 7.11,31.5 7.24,31.37 7.24,29.97 5.33,29.97 4.95,30.35 4.95,31.11 5.97,32.13 | 5.97,32.13 5.97,31.62 6.48,31.11 | 6.48,31.11 6.48,31.37 | 6.48,31.37 6.1,31.75 | 6.48,31.37 6.6,31.24 6.99,31.24 7.11,31.11 7.11,30.23 6.86,30.23 6.73,30.1 | 6.48,30.73 6.48,31.11
  Top 0.61: IC1.3 16.52,32.09 v16.48,32.05
  Top 1.27: SW1.COM1 10.16,38.1 9.4,37.34 6.73,37.34 5.46,36.07 5.46,30.72 6.46,30.72
  Bottom 0.813: J6.1 8.65,32.89 15.65,32.89 v16.48,32.05
  Bottom 1.27: J2.11 14.89,38 14.22,37.34 11.68,37.34 SW1.COM1
VBAT_IN  (via drill 0.3)
  Top 0.508: R5.2 28.7,35.94 28.19,36.45 v22.86,36.45
  Top 0.559: v15.75,34.92 15.62,34.92 14.1,34.92
  Top 0.813: SW1.CH1A 13.08,38.86 14.1,37.85 14.1,35.61 | 14.1,35.61 14.1,34.92 14.1,34.54 | Q2.3 12.4,33.66 R17.1 14.1,34.54 | 14.1,34.54 14.48,34.92 14.78,34.92 | 15.62,34.92 14.78,34.92 | 14.78,34.92 14.1,35.61
  Bottom 0.508: v22.86,36.45 21.72,36.45 20.19,34.92 v15.75,34.92
VBUS  (via drill 0.3)
  Top 0.254: 4.45,11.68 4.45,24.38 5.59,25.53 7.49,25.53 7.62,25.4 7.62,23.88 7.37,23.62 6.1,23.62 5.33,22.86 5.33,13.46 5.84,12.95 5.84,11.68 4.7,11.68 | 4.7,11.68 4.57,11.81 | 4.7,11.81 4.7,24.38 5.71,25.4 7.37,25.4 7.49,25.27 7.49,24 7.24,23.75 5.46,23.75 4.83,23.11 | 4.83,23.11 4.83,12.19 | 4.83,12.19 4.83,11.94 5.59,11.94 5.59,12.95 5.33,13.21 5.33,12.19 5.46,12.06 4.95,12.06 4.83,12.19 | 4.83,23.11 4.83,24.26 5.84,25.27 7.24,25.27 7.37,25.15 7.37,24.13 7.11,23.88 5.33,23.88 4.95,23.5 4.95,24.13 5.97,25.15 7.11,25.15 7.24,25.02 7.24,24.26 6.99,24 5.21,24 5.08,23.88 5.08,24 6.1,25.02 6.99,25.02 7.11,24.89 7.11,24.38 6.86,24.13 5.46,24.13 6.22,24.89 6.86,24.89 6.86,24.38 6.73,24.26 5.84,24.26 6.35,24.77 6.6,24.77 6.73,24.64 6.73,24.51 6.6,24.38 6.48,24.38 | 6.48,24.38 6.22,24.38 6.48,24.64 6.6,24.51 | J1.1 6.48,24.38 | 4.7,11.68 4.73,11.71 J5.1
  Top 0.406: 22.73,33.15 22.73,35.18 21.34,36.58 v20.45,36.58 19.63,36.58 CHG.+ | 21.97,32.13 20.08,32.13 IC1.4 | 22.35,32.13 C9.2 23.75,32.13 22.73,33.15 | J5.1 5.08,22.97 J1.1 | 22.73,33.15 22.73,32.89 21.97,32.13 | 21.97,32.13 22.35,32.13 | 22.35,32.13 22.86,32.64 22.99,32.64 23.24,32.38 23.11,32.38 22.99,32.26
  Bottom 0.406: 15.24,35.69 14.35,34.8 | 14.35,34.8 14.22,34.67 | 14.22,34.67 13.59,34.67 | 11.3,34.67 9.53,34.67 | 15.24,35.69 19.56,35.69 v20.45,36.58 20.57,36.7 20.07,36.7 19.43,36.07 14.99,36.07 13.59,34.67 | 4.7,32.89 4.7,33.02 | 6.99,23.88 5.59,23.88 4.19,25.27 4.19,33.15 5.59,34.54 8.89,34.54 9.53,35.18 9.53,36.2 9.78,36.45 10.54,36.45 10.79,36.2 10.79,35.18 11.3,34.67 | 11.3,34.67 13.59,34.67 | 15.24,35.69 14.86,35.69 14.1,34.92 14.22,34.92 14.35,34.8 | 14.22,34.67 13.59,34.04 7.49,34.04 5.08,31.62 5.08,25.65 5.84,24.89 6.99,24.89 7.11,24.77 7.11,23.88 6.99,23.88 | 6.99,23.88 6.73,24.13 6.73,24.51 6.86,24.64 5.46,24.64 4.83,25.27 4.83,31.75 7.24,34.16 6.86,34.16 4.95,32.26 4.95,32.64 6.35,34.04 9.4,34.04 9.78,34.42 11.3,34.42 | 13.59,34.42 11.3,34.42 | 11.3,34.42 10.54,35.18 10.54,35.94 10.41,36.07 9.91,36.07 9.91,35.56 9.78,35.43 9.91,35.43 10.54,34.8
  Bottom 0.61: SW1.COM2 10.16,35.31 9.53,34.67 9.27,34.42 6.1,34.42 4.7,33.02 | J1.1 5.73,24.37 4.83,25.27 4.7,25.4 4.7,32.89
VDDCORE
  Top 0.305: IC2.43 8.28,16.77 C7.1
VIN
  Top 0.254: D3.C 9.71,32.07 Q2.2
  Top 0.305: U5.8 13.18,30.43 | 13.18,30.43 11.36,30.43 D3.C | 13.18,30.43 13.21,30.46 R17.2 C17.2 15.81,31.43 U5.5 C10.2
  pour Top: 18.21,30.1 15.77,30.1 15.77,30.96 15.42,31.32 14.2,31.32 13.97,31.09 13.97,30.2 13.39,30.2 12.7,29.51 9.32,29.51 9.32,32.41 10.59,32.41 10.87,32.13 12.55,32.13 12.88,32.46 15.52,32.46 15.75,32.23 15.75,31.7 16.38,31.06 18.21,31.06
VSYS
  Top 0.305: 13.08,36.45 13.13,36.45
  Top 0.406: 3.68,25.02 3.68,25.27 5.08,26.67 6.99,26.67 8.26,27.94 8.26,32.56 | 10.92,34.04 10.86,33.97 Q2.1 8.26,32.56 | SW1.CH2A 10.92,34.04 | 10.92,34.04 9.65,34.04 8.26,32.64 8.26,32.56 | 3.25,25.53 4.93,27.2 6.91,27.2 7.98,28.27 7.98,33.25 8.97,34.24 10.52,34.24 11.76,35.48 11.76,36.09 12.29,36.63 13.01,36.63 13.13,36.5 13.13,36.45 13.13,36.22 10.57,33.66 9.5,33.66 8.41,32.56 8.41,28.85 | 8.41,28.85 8.41,27.94 6.99,26.52 5.18,26.52 3.68,25.02 | 3.68,25.02 3.48,25.02 3.48,25.43 4.98,26.92 6.96,26.92 7.3,27.27 8.08,28.04 8.08,32.89 9.17,33.98 10.59,33.98 12.93,36.32 12.55,36.32 12.47,36.4 12.47,36.27 11.91,35.71 11.91,35.74 | 11.58,34.9 12.5,34.9 13.13,35.53 13.13,36.4 13.08,36.45 13.08,35.87 12.34,35.13 | R10.2 1.8,20.02 3.48,21.69 | 3.48,24.82 3.68,25.02 | 3.68,25.83 3.56,25.83 2.82,25.09 2.82,21.92 1.47,20.57 1.47,18.21 2.16,18.21 2.16,20.24 3.48,21.57 3.48,21.69 | 3.48,21.69 3.48,24.82 | 3.48,24.82 3.15,25.15 3.15,21.77 1.7,20.32 | 10.16,27.41 9.02,27.41 9.02,27.91 9.02,28.25 8.41,28.85
  Top 0.813: R15.1 7.64,27.61 7.3,27.27
  Top 1.016: 8.41,27.94 9.79,27.94 D3.A

### Text on the board
tPlace: VBAT | GND | 3V3 | D9 | D8 | D7 | D6 | D5 | D4 | D3 | D2 | VBAT | + | - | + | - | CHG | 3V3 | GND | DIO | CLK | SDA | SCL | 3V3 | GND | SWD | RST | D13 | D12 | D11 | D10 | A0 | A1 | A2 | A3 | A4 | A5
bPlace: OFF | ON | Maduino Zero | Lorawan Node v1.0 | www.makerfabs.com